# Altium project Morpheus_pill.PrjPcb
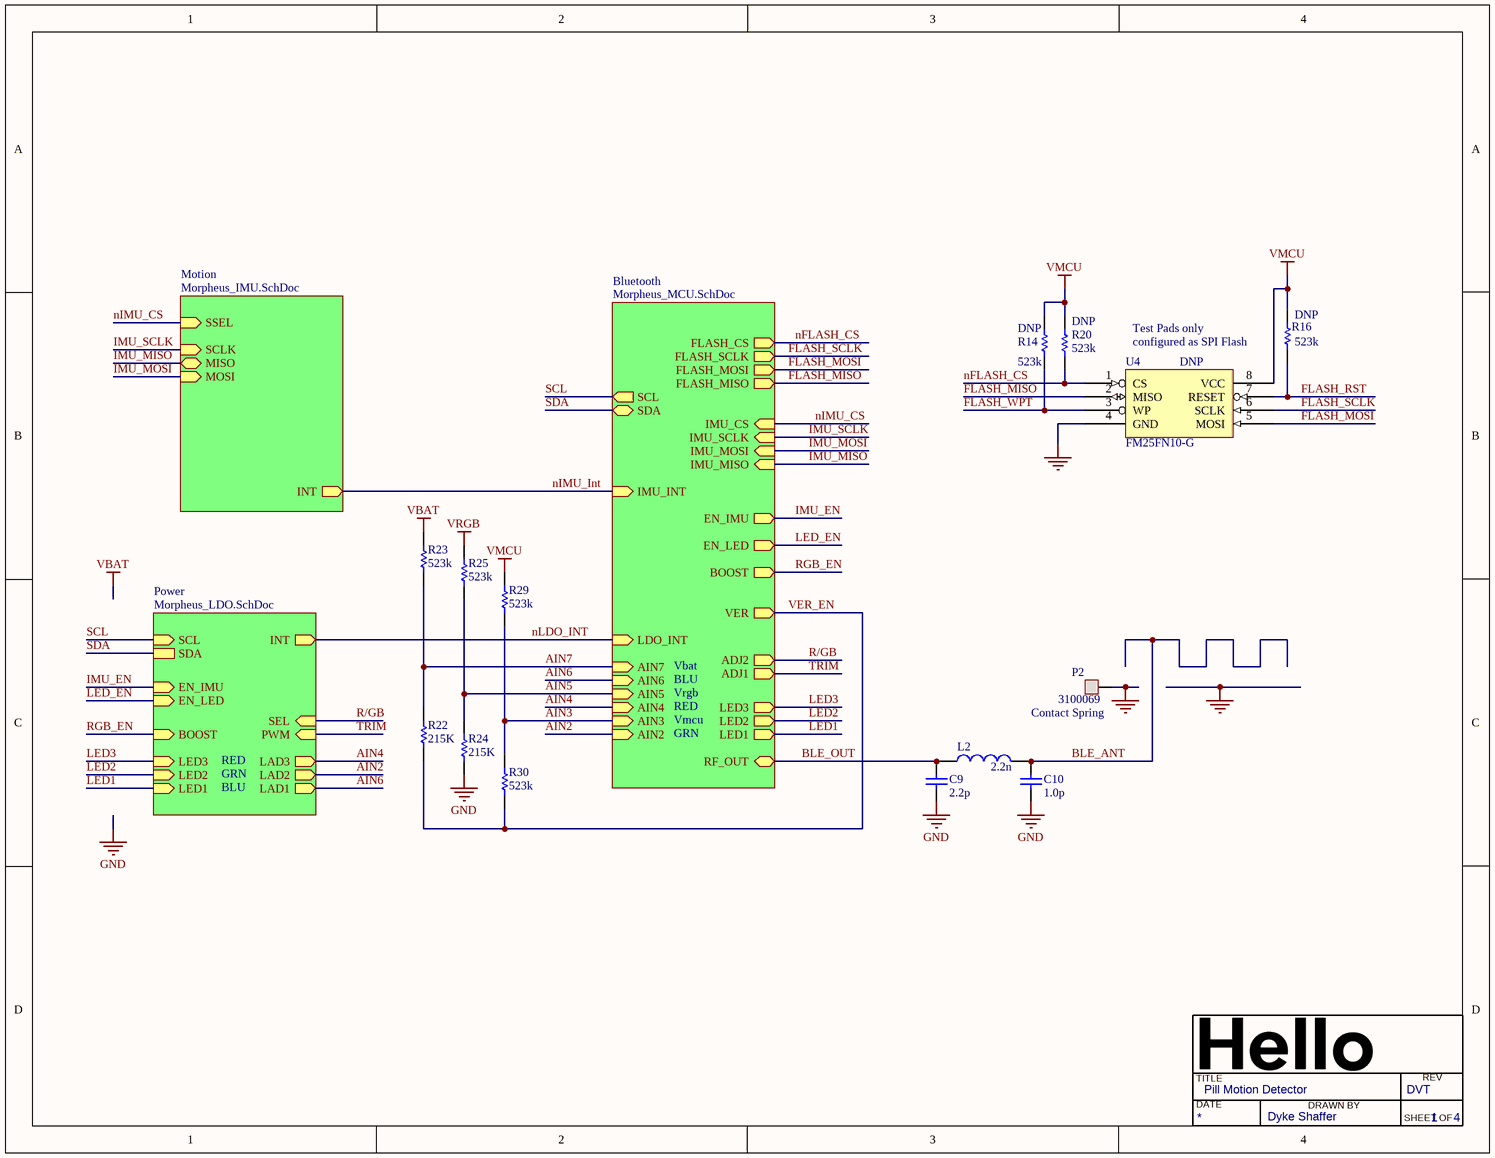
[diagram p0: Morpheus_pill.SchDoc]
4 sheets, 81 parts. Net scope: hierarchical (ports join the sheet entries above them; power ports are global).
Board file: Morpheus_pill.PcbDoc
Sheets:
  Morpheus_pill.SchDoc
    Bluetooth = Morpheus_MCU.SchDoc
    Motion = Morpheus_IMU.SchDoc
    Power = Morpheus_LDO.SchDoc

## Sheet Morpheus_pill.SchDoc: Pill Motion Detector
size Letter; DrawnBy: Dyke Shaffer; Organization: Hello Inc.; Revision: DVT; SheetNumber: 1; SheetTotal: 4

### Parts
(Parts that share a designator on the sheet are numbered #1, #2 ... from top to bottom, then left to right.)
C9  2.2p  [CAP0201_SENSE_DVT]
C10  1.0p  [CAP0201_SENSE_DVT]
L2  2.2n  [IND_0402]
P2#1  Contact Spring  PN: 3100069  [TP120X70SC]
R14  DNP  value 523k  [RES0402_SENSE_DVT]
R16  DNP  value 523k  [RES0402_SENSE_DVT]
R20  DNP  value 523k  [RES0402_SENSE_DVT]
R22  215K  [RES0402_SENSE_DVT]
R23  523k  [RES0402_SENSE_DVT]
R24  215K  [RES0402_SENSE_DVT]
R25  523k  [RES0402_SENSE_DVT]
R29  523k  [RES0402_SENSE_DVT]
R30  523k  [RES0402_SENSE_DVT]
U4  DNP  PN: FM25FN10-G  [DFN127P600x500x80-8D]

### Sub-sheets
Bluetooth = Morpheus_MCU.SchDoc: FLASH_SCLK (out), FLASH_CS (out), IMU_INT (in), LED3 (out), EN_IMU (out), AIN6 (in), LDO_INT (in), SCL (out), SDA, AIN7 (in), EN_LED (out), AIN4 (in), AIN5 (in), AIN2 (in), AIN3 (in), RF_OUT, ADJ2 (out), ADJ1 (out), LED2 (out), LED1 (out), BOOST (out), VER (out), IMU_MISO (in), IMU_SCLK (in), IMU_MOSI (in), IMU_CS (in), FLASH_MOSI (out), FLASH_MISO (out)
Motion = Morpheus_IMU.SchDoc: MOSI (in), MISO, SCLK (in), INT (out), SSEL (in)
Power = Morpheus_LDO.SchDoc: SDA, INT (out), SCL (in), LAD3 (out), LAD2 (out), LAD1 (out), SEL (in), EN_LED (in), EN_IMU (in), BOOST (in), PWM (in), LED3 (in), LED2 (in), LED1 (in)

### Nets
GND: C9.2 C10.2 P2#1.1 R24.1 U4.4(GND)
VBAT: R23.2
VMCU: R14.2 R16.2 R20.2 R29.2 U4.8(VCC)
VRGB: R25.2
AIN2: sheet Bluetooth/AIN2, sheet Power/LAD2
AIN3: R29.1 R30.2 ; sheet Bluetooth/AIN3
AIN4: sheet Bluetooth/AIN4, sheet Power/LAD3
AIN5: R24.2 R25.1 ; sheet Bluetooth/AIN5
AIN6: sheet Bluetooth/AIN6, sheet Power/LAD1
AIN7: R22.2 R23.1 ; sheet Bluetooth/AIN7
BLE_ANT: C10.1 L2.2
BLE_OUT: C9.1 L2.1 ; sheet Bluetooth/RF_OUT
FLASH_MISO: U4.2(MISO) ; sheet Bluetooth/FLASH_MISO
FLASH_MOSI: U4.5(MOSI) ; sheet Bluetooth/FLASH_MOSI
FLASH_RST: R16.1 U4.7(RESET)
FLASH_SCLK: U4.6(SCLK) ; sheet Bluetooth/FLASH_SCLK
FLASH_WPT: R14.1 U4.3(WP)
IMU_EN: sheet Bluetooth/EN_IMU, sheet Power/EN_IMU
IMU_MISO: sheet Bluetooth/IMU_MISO, sheet Motion/MISO
IMU_MOSI: sheet Bluetooth/IMU_MOSI, sheet Motion/MOSI
IMU_SCLK: sheet Bluetooth/IMU_SCLK, sheet Motion/SCLK
LED1: sheet Bluetooth/LED1, sheet Power/LED1
LED2: sheet Bluetooth/LED2, sheet Power/LED2
LED3: sheet Bluetooth/LED3, sheet Power/LED3
LED_EN: sheet Bluetooth/EN_LED, sheet Power/EN_LED
nFLASH_CS: R20.1 U4.1(CS) ; sheet Bluetooth/FLASH_CS
nIMU_CS: sheet Bluetooth/IMU_CS, sheet Motion/SSEL
nIMU_Int: sheet Bluetooth/IMU_INT, sheet Motion/INT
nLDO_INT: sheet Bluetooth/LDO_INT, sheet Power/INT
R/GB: sheet Bluetooth/ADJ2, sheet Power/SEL
RGB_EN: sheet Bluetooth/BOOST, sheet Power/BOOST
SCL: sheet Bluetooth/SCL, sheet Power/SCL
SDA: sheet Bluetooth/SDA, sheet Power/SDA
TRIM: sheet Bluetooth/ADJ1, sheet Power/PWM
VER_EN: R22.1 R30.1 ; sheet Bluetooth/VER

### Notes on the sheet
- Test Pads only
- (near R16) configured as SPI Flash
- BLU
- Vbat
- Vrgb
- GRN
- RED
- Vmcu
- TITLE
- DATE
- DRAWN BY
- REV
- SHEET
- OF

### Library data of the parts
C9 = C_2.2p_5_25_C0G_0201: Chip capacitor; Vendor: TDK; PN: C0603C0G1E2R2B030BG; Tolerance: 5%; Voltage: 25V; Temp: C0G; Value: 2.2p; Size: 0201
C10 = C_1p_5_25_C0G_0201: Chip capacitor; Vendor: TDK; PN: C0603C0G1E1R0B030BG; Tolerance: 5%; Voltage: 25V; Temp: C0G; Value: 1.0p; Size: 0201
L2 = L_2.2n_0.1_?_0.150_0.9_?: SMD power inductor, 2.2uH; PN: MLG1005S2N2BT000; Vendor: TDK; Tolerance: 0.1; RDC: 0.150; I_max: 0.9; Value: 2.2n; Q: ?; I_sat: ?
P2#1 = TP-120X70-SC: Test Pad 120x70 mil ( contact spring ); Vendor: TE Connectivity
R14 R16 R20 R23 R25 R29 R30 = R_523k_1_0.1_0402: Chip Resistor; Vendor: Panasonic; Tolerance: 1 %; Power: 0.1 W; PN: ERJ-2RKF5233X; Model: *; Size: 0402
  R23 R25 R29 R30: Value: 523k
R22 R24 = R_215K_1_0.1_0402: Chip Resistor; Vendor: Panasonic; Tolerance: 1 %; Power: 0.1 W; PN: ERJ-2RKF2153X; Model: *; Value: 215K; Size: 0402
U4 = FM25VN10-G: Cypress SPI FRAM 128Kx8; Vendor: Fujitsu

## Sheet Morpheus_MCU.SchDoc: Bluetooth Low Energy MCU
size Letter; Author: Dyke Shaffer; CompanyName: Hello, Inc.; Engineer: Dyke Shaffer; Organization: Hello, Inc.; Revision: DVT; SheetNumber: 4; SheetTotal: 4
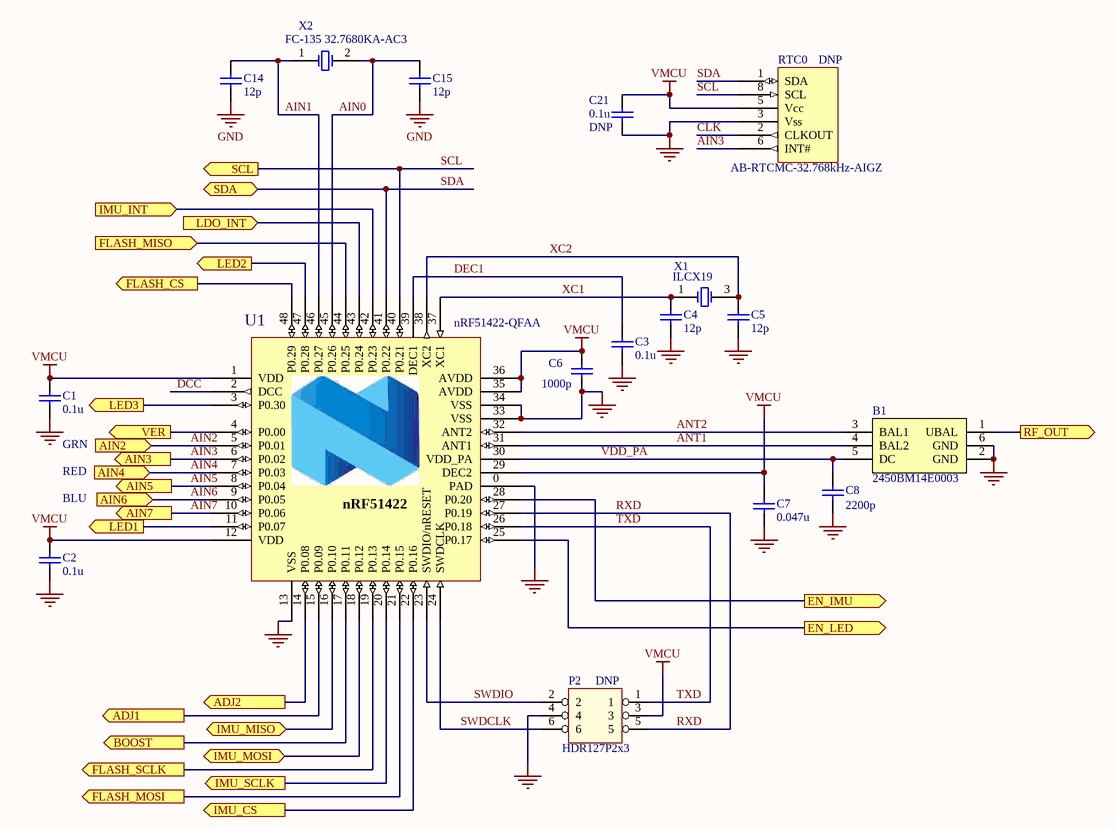
[diagram p1: Morpheus_MCU.SchDoc]

### Parts
(Parts that share a designator on the sheet are numbered #1, #2 ... from top to bottom, then left to right.)
B1  2450BM14E0003  [DFN50P160X80X70-6N]
C1  0.1u  [CAP0402_SENSE_DVT]
C2  0.1u  [CAP0402_SENSE_DVT]
C3  0.1u  [CAP0402_SENSE_DVT]
C4  12p  [CAP0402_SENSE_DVT]
C5  12p  [CAP0402_SENSE_DVT]
C6  1000p  [CAP0201_SENSE_DVT]
C7  value 0.047u  [CAP0201_SENSE_DVT]  (hidden comment: C_0.047u_10_16_X5R_0201)
C8  2200p  [CAP0201_SENSE_DVT]
C14  12p  [CAP0402_SENSE_DVT]
C15  12p  [CAP0402_SENSE_DVT]
C21  DNP  value 0.1u  [CAP0402_SENSE_DVT]
P2#2  DNP  PN: HDR127P2x3  [HDR1.27-2X3-N]
RTC0  DNP  [8-CLCC]
U1  nRF51422-QFAA  [VQFN40P600X600X100-48]
X1  ILCX19  [ILCX19]
X2  FC-135 32.7680KA-AC3  [Epson_FC-135]

### Ports
ADJ1 (out), ADJ2 (out), AIN2 (in), AIN3 (out), AIN4 (in), AIN5 (out), AIN6 (in), AIN7 (out), BOOST (out), EN_IMU (out), EN_LED (out), FLASH_CS (out), FLASH_MISO (in), FLASH_MOSI (out), FLASH_SCLK (out), IMU_CS (out), IMU_INT (in), IMU_MISO, IMU_MOSI, IMU_SCLK (out), LDO_INT (in), LED1 (out), LED2 (out), LED3 (out), RF_OUT (out), SCL (out), SDA, VER (out)

### Nets
GND: B1.2(GND) B1.6(GND) C1.1 C2.1 C3.1 C4.1 C5.1 C6.1 C7.1 C8.1 C14.1 C15.1 C21.1 P2#2.4 RTC0.3(Vss) U1.0(PAD) U1.13(VSS) U1.33(VSS) U1.34(VSS)
VMCU: C1.2 C2.2 C6.2 C7.2 C21.2 P2#2.3 RTC0.5(Vcc) U1.1(VDD) U1.12(VDD) U1.29(DEC2) U1.35(AVDD) U1.36(AVDD)
AIN0: C15.2 U1.45(P0.26) X2.2
AIN1: C14.2 U1.46(P0.27) X2.1
AIN2: U1.5(P0.01) ; port AIN2
AIN3: RTC0.6(INT#) U1.6(P0.02) ; port AIN3
AIN4: U1.7(P0.03) ; port AIN4
AIN5: U1.8(P0.04) ; port AIN5
AIN6: U1.9(P0.05) ; port AIN6
AIN7: U1.10(P0.06) ; port AIN7
ANT1: B1.4(BAL2) U1.31(ANT1)
ANT2: B1.3(BAL1) U1.32(ANT2)
BLE_OUT: B1.1(UBAL) ; port RF_OUT
CLK: RTC0.2(CLKOUT)
DCC: U1.2(DCC)
DEC1: C3.2 U1.39(DEC1)
FLASH_MISO: U1.44(P0.25) ; port FLASH_MISO
FLASH_MOSI: U1.21(P0.15) ; port FLASH_MOSI
FLASH_SCLK: U1.19(P0.13) ; port FLASH_SCLK
IMU_EN: U1.28(P0.20) ; port EN_IMU
IMU_MISO: U1.16(P0.10) ; port IMU_MISO
IMU_MOSI: U1.18(P0.12) ; port IMU_MOSI
IMU_SCLK: U1.20(P0.14) ; port IMU_SCLK
LED1: U1.11(P0.07) ; port LED1
LED2: U1.47(P0.28) ; port LED2
LED3: U1.3(P0.30) ; port LED3
LED_EN: U1.25(P0.17) ; port EN_LED
nFLASH_CS: U1.48(P0.29) ; port FLASH_CS
nIMU_CS: U1.22(P0.16) ; port IMU_CS
nIMU_Int: U1.42(P0.23) ; port IMU_INT
nLDO_INT: U1.43(P0.24) ; port LDO_INT
R/GB: U1.14(P0.08) ; port ADJ2
RGB_EN: U1.17(P0.11) ; port BOOST
RXD: P2#2.5 U1.27(P0.19)
SCL: RTC0.8(SCL) U1.40(P0.21) ; port SCL
SDA: RTC0.1(SDA) U1.41(P0.22) ; port SDA
SWDCLK: P2#2.6 U1.24(SWDCLK)
SWDIO: P2#2.2 U1.23(SWDIO/nRESET)
TRIM: U1.15(P0.09) ; port ADJ1
TXD: P2#2.1 U1.26(P0.18)
VDD_PA: B1.5(DC) C8.2 U1.30(VDD_PA)
VER_EN: U1.4(P0.00) ; port VER
XC1: C4.2 U1.37(XC1) X1.1(XTAL1)
XC2: C5.2 U1.38(XC2) X1.3(XTAL2)

Not connected (* = marked no-connect by the designer): RTC0 4(NC) 7(NC)

### Notes on the sheet
- (near C1) GRN
- RED
- (near C2) BLU
- TITLE
- DATE
- DRAWN BY
- REV
- SHEET
- OF
- (in symbol nRF51422_QFAA) nRF51422

### Library data of the parts
B1 = 2450BM14E0003: 2.45 GHz Impedance Matched Balun-Filter; Vendor: Johanson; PN: 2450BM14E0003
C1-C3 C21 = C_0.1u_10_50_X7R_0402: Chip capacitor; Vendor: Taiyo Yuden; PN: UMK105B7104KV-FR; Tolerance: 10%; Voltage: 50V; Temp: X7R; Size: 0402
  C1-C3: Value: 0.1u
C4 C5 C14 C15 = C_12p_5_50_C0G_0402: Chip capacitor; Vendor: Murata; PN: GRM1555C1H120JA01D; Tolerance: 5%; Voltage: 50V; Temp: C0G; Value: 12p; Size: 0402
C6 = C_1000p_10_25_X7R_0201: Chip capacitor; Vendor: Taiyo Yuden; PN: TMK063B7102KP-F; Tolerance: 10%; Voltage: 25V; Temp: X7R; Value: 1000p; Size: 0201
C7 = C_0.047u_10_16_X5R_0201: Chip capacitor; Vendor: Murata; PN: GRM033R61C473KE84D; Tolerance: 10%; Voltage: 16V; Temp: X5R; Size: 0201
C8 = C_2200p_5_16_X7R_0201: Chip capacitor; Vendor: Murata; PN: GRM033R71C222KA88D; Tolerance: 5 %; Voltage: 16V; Type: X7R; Value: 2200p; Size: 0201
P2#2 = HDR1.27-2x3-N: Value: HDR1.27-2X3-N
RTC0 = AB-RTCMC-32.768kHz-AIGZ: Abracon I2C RTC w/ integrated XO; PN: AB-RTCMC-32.768kHz-AIGZ
U1 = nRF51422_QFAA: Multi-protocol Bluetooth Low Energy, ANT and 2.4GHz proprietary system-on-chip; Vendor: Nordic Semiconductor; PN: nRF51422-QFAA
X1 = ILCX19: ILSI ILCX19 Crystal Oscillator; PN: ILCX19
X2 = Espon_FC-135 32.7680KA-AC3: Epson 32kHz crystal, 9pF; PN: FC-135 32.7680KA-AC3; Vendor: Epson

## Sheet Morpheus_IMU.SchDoc: IMU Motion Detecter
size Letter; CompanyName: Hello Inc.; Organization: Hello Inc.; Revision: DVT; SheetNumber: 3; SheetTotal: 4
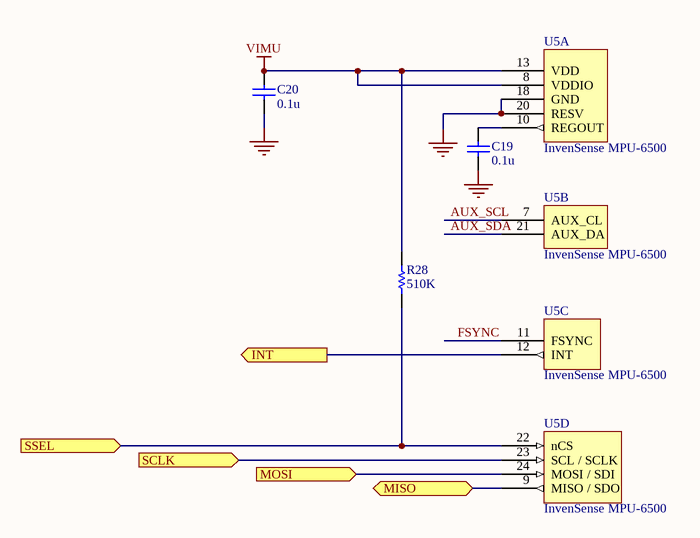
[diagram p2: Morpheus_IMU.SchDoc]

### Parts
C19  0.1u  [CAP0402_SENSE_DVT]
C20  0.1u  [CAP0402_SENSE_DVT]
R28  510K  [RES0402_SENSE_DVT]
U5  InvenSense MPU-6500  [QFN-24]  (parts A,B,C,D of 4)

### Ports
INT (out), MISO, MOSI (in), SCLK (in), SSEL (in)

### Nets
GND: C19.1 C20.1 U5.18(GND) U5.20(RESV)
VIMU: C20.2 R28.2 U5.8(VDDIO) U5.13(VDD)
AUX_SCL: U5.7(AUX_CL)
AUX_SDA: U5.21(AUX_DA)
FSYNC: U5.11(FSYNC)
IMU_MISO: U5.9(MISO_/_SDO) ; port MISO
IMU_MOSI: U5.24(MOSI_/_SDI) ; port MOSI
IMU_SCLK: U5.23(SCL_/_SCLK) ; port SCLK
nIMU_CS: R28.1 U5.22(nCS) ; port SSEL
nIMU_Int: U5.12(INT) ; port INT
NetC19_2: C19.2 U5.10(REGOUT)

### Notes on the sheet
- TITLE
- DATE
- DRAWN BY
- REV
- SHEET
- OF

### Library data of the parts
C19 C20 = C_0.1u_10_50_X7R_0402: as C1 on sheet Morpheus_MCU; Value: 0.1u; Size: 0402
R28 = R_510K_5_0.1_0402: Chip Resistor; Vendor: Panasonic; Tolerance: 5 %; Power: 0.1 W; PN: ERJ-2GEJ514X; Model: *; Value: 510K; Size: 0402
U5 = MPU-6500: InvenSense MPU-6500 6-axis accelerometer and gyroscope; PN: MPU-6500

## Sheet Morpheus_LDO.SchDoc: LDO with Boost Converter
size Letter; CompanyName: Hello Inc.; DrawnBy: Dyke Shaffer; Organization: Hello Inc.; Revision: DVT; SheetNumber: 2; SheetTotal: 4
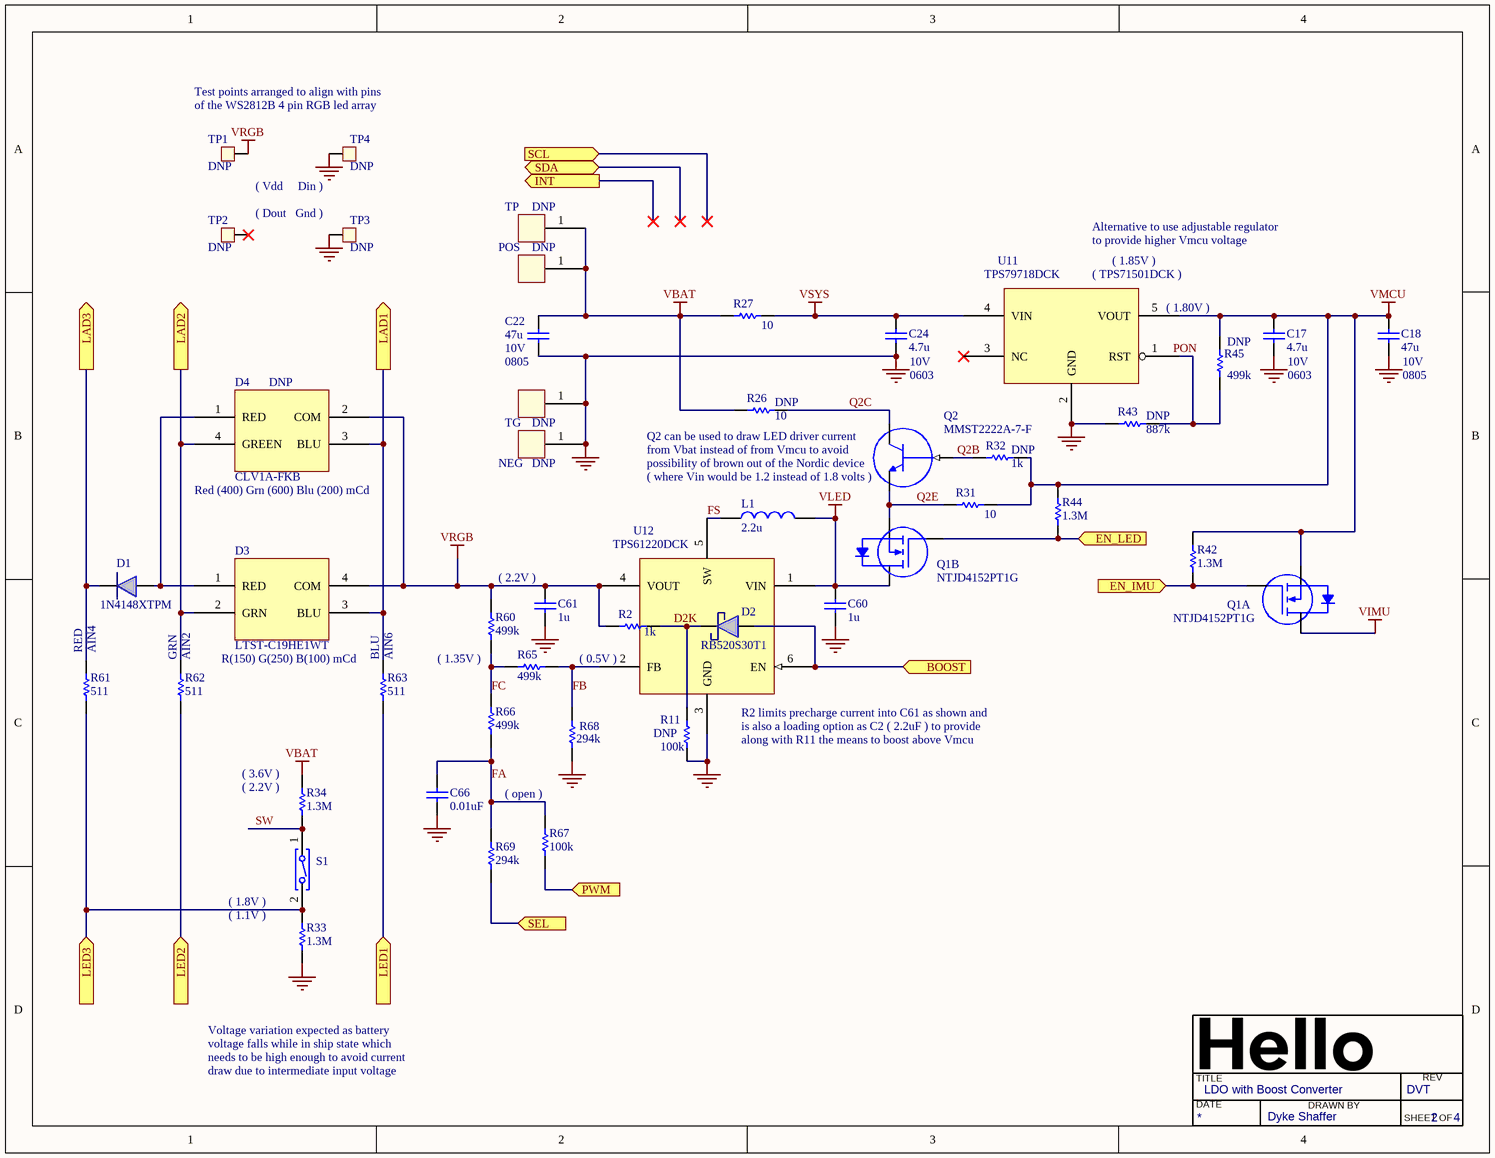
[diagram p3: Morpheus_LDO.SchDoc]

### Parts
C17  4.7u  Size: 0603  Voltage: 10V  [CAP0603_SENSE_DVT]
C18  47u  Size: 0805  Voltage: 10V  [CAP0805_SENSE_DVT]
C22  47u  Size: 0805  Voltage: 10V  [CAP0805_SENSE_DVT]
C24  4.7u  Size: 0603  Voltage: 10V  [CAP0603_SENSE_DVT]
C60  1u  [CAP0402_SENSE_DVT]
C61  1u  [CAP0402_SENSE_DVT]
C66  0.01uF  [CAP0402_SENSE_DVT]
D1  1N4148XTPM  [SOD523]
D2  RB520S30T1  [SOD523]
D3  LTST-C19HE1WT  value R(150) G(250) B(100) mCd  [DFN120X85P160X160X35-4R]
D4  DNP  value Red (400) Grn (600) Blu (200) mCd  [PLCC150X290P280X320X35-4]
L1  2.2u  [IND_1206]
NEG  DNP  [TP0875x050]
POS  DNP  [TP0875x050]
Q1  NTJD4152PT1G  [SOT65P212X110-6N]  (parts A,B of 2)
Q2  PN: MMST2222A-7-F  [SOT-323]  (hidden comment: MMST2222A)
R2  value 1k  [RES0402_SENSE_DVT]
R11  DNP  value 100k  [RES0402_SENSE_DVT]
R26  DNP  value 10  [RES0402_SENSE_DVT]
R27  10  [RES0402_SENSE_DVT]
R31  10  [RES0402_SENSE_DVT]
R32  DNP  value 1k  [RES0402_SENSE_DVT]
R33  1.3M  [RES0402_SENSE_DVT]
R34  1.3M  [RES0402_SENSE_DVT]
R42  1.3M  [RES0402_SENSE_DVT]
R43  DNP  value 887k  [RES0402_SENSE_DVT]
R44  1.3M  [RES0402_SENSE_DVT]
R45  DNP  value 499k  [RES0402_SENSE_DVT]
R60  499k  [RES0402_SENSE_DVT]
R61  511  [RES0402_SENSE_DVT]
R62  511  [RES0402_SENSE_DVT]
R63  511  [RES0402_SENSE_DVT]
R65  499k  [RES0402_SENSE_DVT]
R66  499k  [RES0402_SENSE_DVT]
R67  100k  [RES0402_SENSE_DVT]
R68  294k  [RES0402_SENSE_DVT]
R69  294k  [RES0402_SENSE_DVT]
S1  REED_SPST_NO  [REED-10x1.8]  (value not drawn)
TG  DNP  [TP0875x050]
TP  DNP  [TP0875x050]
TP1  DNP  [TP-0.8]
TP2  DNP  [TP-0.8]
TP3  DNP  [TP-0.8]
TP4  DNP  [TP-0.8]
U11  TPS79718DCK  [SOT65P212X110-5N]
U12  TPS61220DCK  [SOT65P212X110-6N]

### Ports
BOOST (in), EN_IMU (in), EN_LED (in), INT (out), LAD1 (out), LAD2 (out), LAD3 (out), LED1 (in), LED2 (in), LED3 (in), PWM (in), SCL (in), SDA, SEL (in)

### Nets
GND: C17.1 C18.1 C22.1 C24.1 C60.1 C61.1 C66.1 NEG.1 R11.1 R33.1 R43.1 R68.1 TG.1 TP3.1 TP4.1 U11.2(GND) U12.3(GND)
VBAT: C22.2 POS.1 R26.1 R27.1 R34.2 TP.1
VIMU: Q1.6(D1)
VLED: C60.2 L1.1 Q1.3(D2) U12.1(VIN)
VMCU: C17.2 C18.2 Q1.1(S1) R31.2 R32.2 R42.2 R44.2 R45.2 U11.5(VOUT)
VRGB: C61.2 D3.4(COM) D4.2(COM) R2.1 R60.2 TP1.1 U12.4(VOUT)
VSYS: C24.2 R27.2 U11.4(VIN)
AIN2: D3.2(GRN) D4.4(GREEN) R62.2 ; port LAD2
AIN4: D1.1(Cathode) R61.2 ; port LAD3
AIN6: D3.3(BLU) D4.3(BLU) R63.2 ; port LAD1
D2K: D2.1(Cathode) R2.2 R11.2
FA: C66.2 R66.1 R67.2 R69.2
FB: R65.1 R68.2 U12.2(FB)
FC: R60.1 R65.2 R66.2
FS: L1.2 U12.5(SW)
IMU_EN: Q1.2(G1) R42.1 ; port EN_IMU
LED1: R63.1 ; port LED1
LED2: R62.1 ; port LED2
LED3: R33.2 R61.1 S1.2 ; port LED3
LED_EN: Q1.5(G2) R44.1 ; port EN_LED
Q2B: Q2.1(IN) R32.1
Q2C: Q2.3(OUT) R26.2
Q2E: Q1.4(S2) Q2.2(GND) R31.1
R/GB: R69.1 ; port SEL
RGB_EN: D2.2(Anode) U12.6(EN) ; port BOOST
SW: R34.1 S1.1
TRIM: R67.1 ; port PWM
NetD1_2: D1.2(Anode) D3.1(RED) D4.1(RED)
NetR43_2: R43.2 R45.1 U11.1(RST)

Not connected (* = marked no-connect by the designer): TP2 1*; U11 3(NC)*

### Notes on the sheet
- Test points arranged to align with pins
- of the WS2812B 4 pin RGB led array
- ( Dout   Gnd )
- ( Vdd     Din )
- Alternative to use adjustable regulator
- (near U11) ( TPS71501DCK )
- to provide higher Vmcu voltage
- (near U11) ( 1.85V )
- ( 1.80V )
- (near Q2) Q2 can be used to draw LED driver current
- (near Q2) from Vbat instead of from Vmcu to avoid
- (near Q2) possibility of brown out of the Nordic device
- (near Q2) ( where Vin would be 1.2 instead of 1.8 volts )
- (near C61) ( 2.2V )
- (near R61) RED
- (near R61) AIN4
- (near R62) GRN
- (near R62) AIN2
- (near R63) BLU
- (near R63) AIN6
- (near R60) ( 1.35V )
- (near U12) ( 0.5V )
- (near R34) ( 3.6V )
- (near U12) R2 limits precharge current into C61 as shown and
- (near U12) is also a loading option as C2 ( 2.2uF ) to provide
- along with R11 the means to boost above Vmcu
- (near R34) ( 2.2V )
- ( open )
- ( 1.8V )
- ( 1.1V )
- Voltage variation expected as battery
- voltage falls while in ship state which
- needs to be high enough to avoid current
- draw due to intermediate input voltage
- Labels drawn without touching a wire or pin: PON
- TITLE
- DATE
- DRAWN BY
- REV
- SHEET
- OF

### Library data of the parts
C17 C24 = C_4.7u_20_10_X5R_0603: Chip capacitor; Vendor: TDK; PN: CGB3B1X5R1A475M055AC; Tolerance: 20%; Temp: X5R; Value: 4.7u
C18 C22 = C_47u_20_10_X5R_0805: Chip capacitor; Vendor: TDK; PN: C2012X5R1A476M125AC; Tolerance: 20%; Temp: X5R; Value: 47u
C60 C61 = C_1u_10_6.3_X5R_0402: Chip capacitor; Vendor: Taiyo Yuden; PN: JMK105BJ105KV-F; Tolerance: 10%; Voltage: 6.3V; Temp: X5R; Value: 1u; Size: 0402
C66 = C_10000p_10_50_X7R_0402: Chip capacitor; Value: 10000p; Vendor: Taiyo Yuden; PN: UMK105B7103KV-F; Tolerance: 10%; Voltage: 50; Temp: X7R; Size: 0402
D1 = 1N4148XTPM: Silicon diode, 30V 200mA; Vendor: ON Semi; PN: 1N4148XTPM
D2 = RB520S30T1: Schottky diode, 30V 200mA; Vendor: ON Semi; PN: RB520S30T1
D3 = LTST-C19HE1WT: RGB LED Array; Vendor: LiteOn; PN: LTST-C19HE1WT
D4 = CLV1A-FKB: RGB LED Array; Vendor: CREE; PN: CLV1A-FKB
L1 = L_2.2u_1206: SMD power inductor, 2.2uH; PN: LQM31PN2R2M00; Vendor: Murata; Tolerance: 20%; RDC: 0.19; I_max: 0.9; I_sat: 1.0; Value: 2.2u; Q: ?
NEG TG = 5016: Single-pad test point
POS TP = 5016: Single-pad test point; Value: TP0875x050
Q1 = NTJD4152PT1G: Vishay Dual N-Channel MOSFET 1.2v drive 20V 0.88A; Vendor: ON Semi; PN: NTJD4152PT1G
Q2 = MMST2222A: NPN Transistor, 20V, 600mA; Vendor: Diodes Inc
R2 R32 = R_1k_1_0.1_0402: Chip Resistor; Vendor: Panasonic; Tolerance: 1 %; Power: 0.1 W; PN: ERJ-2RKF1001X; Model: *; Size: 0402
R11 R67 = R_100k_1_0.1_0402: Chip Resistor; Vendor: Panasonic; Tolerance: 1 %; Power: 0.1 W; PN: ERJ-2RKF1003X; Model: *; Size: 0402
  R67: Value: 100k
R26 R27 R31 = R_10_1_0.1_0402: Chip Resistor; Vendor: Panasonic; Tolerance: 1 %; Power: 0.1 W; PN: ERJ-2RKF10R0X; Model: *; Size: 0402
  R27 R31: Value: 10
R33 R34 R42 R44 = R_1.3M_5_0.1_0402: Chip Resistor; Vendor: Panasonic; Tolerance: 5 %; Power: 0.1 W; PN: ERJ-2GEJ135X; Model: *; Value: 1.3M; Size: 0402
R43 = R_887k_1_0.1_0402: Chip Resistor; Vendor: Panasonic; Tolerance: 1 %; Power: 0.1 W; PN: ERJ-2RKF8873X; Model: *; Size: 0402
R45 R60 R65 R66 = R_499k_1_0.1_0402: Chip Resistor; Vendor: Panasonic; Tolerance: 1 %; Power: 0.1 W; PN: ERJ-2RKF4993X; Model: *; Size: 0402
  R60 R65 R66: Value: 499k
R61-R63 = R_511_1_0.1_0402: Chip Resistor; Vendor: Panasonic; Tolerance: 1 %; Power: 0.1 W; PN: ERJ-2RKF5110X; Model: *; Value: 511; Size: 0402
R68 R69 = R_294k_1_0.1_0402: Chip Resistor; Vendor: Panasonic; Tolerance: 1 %; Power: 0.1 W; PN: ERJ-2RKF2943X; Model: *; Value: 294k; Size: 0402
S1 = SW_REED_SPST_NO: SWITCH REED SPST NO; PN: ORD213-1015; Vendor: ORD
TP1-TP4 = TP-0.8: testpoint; PN: Test Point
U11 = TPS79718DCK: LDO 1.8V SC70-5; Vendor: TI; PN: TPS79718DCK
U12 = TPS61220: Boost Converter; Vendor: TI; PN: TPS61220DCK

## Nets that join several sheets
GND: Morpheus_pill (5 pins), Morpheus_MCU (19 pins), Morpheus_IMU (C19.1 C20.1 U5.18 U5.20), Morpheus_LDO (17 pins)
VBAT: Morpheus_pill (R23.2), Morpheus_LDO (6 pins)
VIMU: Morpheus_IMU (C20.2 R28.2 U5.8 U5.13), Morpheus_LDO (Q1.6)
VMCU: Morpheus_pill (5 pins), Morpheus_MCU (12 pins), Morpheus_LDO (9 pins)
VRGB: Morpheus_pill (R25.2), Morpheus_LDO (7 pins)
AIN2: Morpheus_MCU (U1.5), Morpheus_LDO (D3.2 D4.4 R62.2)
AIN3: Morpheus_pill (R29.1 R30.2), Morpheus_MCU (RTC0.6 U1.6)
AIN4: Morpheus_MCU (U1.7), Morpheus_LDO (D1.1 R61.2)
AIN5: Morpheus_pill (R24.2 R25.1), Morpheus_MCU (U1.8)
AIN6: Morpheus_MCU (U1.9), Morpheus_LDO (D3.3 D4.3 R63.2)
AIN7: Morpheus_pill (R22.2 R23.1), Morpheus_MCU (U1.10)
BLE_OUT: Morpheus_pill (C9.1 L2.1), Morpheus_MCU (B1.1)
FLASH_MISO: Morpheus_pill (U4.2), Morpheus_MCU (U1.44)
FLASH_MOSI: Morpheus_pill (U4.5), Morpheus_MCU (U1.21)
FLASH_SCLK: Morpheus_pill (U4.6), Morpheus_MCU (U1.19)
IMU_EN: Morpheus_MCU (U1.28), Morpheus_LDO (Q1.2 R42.1)
IMU_MISO: Morpheus_MCU (U1.16), Morpheus_IMU (U5.9)
IMU_MOSI: Morpheus_MCU (U1.18), Morpheus_IMU (U5.24)
IMU_SCLK: Morpheus_MCU (U1.20), Morpheus_IMU (U5.23)
LED1: Morpheus_MCU (U1.11), Morpheus_LDO (R63.1)
LED2: Morpheus_MCU (U1.47), Morpheus_LDO (R62.1)
LED3: Morpheus_MCU (U1.3), Morpheus_LDO (R33.2 R61.1 S1.2)
LED_EN: Morpheus_MCU (U1.25), Morpheus_LDO (Q1.5 R44.1)
nFLASH_CS: Morpheus_pill (R20.1 U4.1), Morpheus_MCU (U1.48)
nIMU_CS: Morpheus_MCU (U1.22), Morpheus_IMU (R28.1 U5.22)
nIMU_Int: Morpheus_MCU (U1.42), Morpheus_IMU (U5.12)
R/GB: Morpheus_MCU (U1.14), Morpheus_LDO (R69.1)
RGB_EN: Morpheus_MCU (U1.17), Morpheus_LDO (D2.2 U12.6)
TRIM: Morpheus_MCU (U1.15), Morpheus_LDO (R67.1)
VER_EN: Morpheus_pill (R22.1 R30.1), Morpheus_MCU (U1.4)